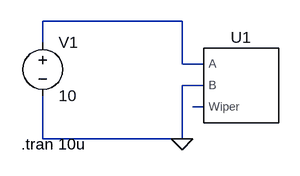
[diagram p0: schematic Test (If Spice works) Poti.asc]
Test (If Spice works) Poti.asc, the LTspice schematic file:
Version 4.1
SHEET 1 880 680
WIRE 192 48 -16 48
WIRE -16 80 -16 48
WIRE 192 112 192 48
WIRE 224 112 192 112
WIRE 224 144 192 144
WIRE 224 176 208 176
WIRE -16 224 -16 160
WIRE 192 224 192 144
WIRE 192 224 -16 224
FLAG 192 224 0
SYMBOL voltage -16 64 R0
WINDOW 123 0 0 Left 0
WINDOW 39 0 0 Left 0
SYMATTR InstName V1
SYMATTR Value 10
SYMBOL Poti 288 144 M0
SYMATTR InstName U1
SYMATTR SpiceLine R={10k} D={50}
TEXT -48 232 Left 2 !.tran 10u

The netlist it stands for:
* Test (If Spice works) Poti.asc
V1 N001 0 10
U1 N001 0 N002 R={10k} D={50}
.tran 10u
.backanno
.end